# Altium schematic sheet DCM y ULTRASONIDO 1.3 .SchDoc
size A4; SheetNumber: 3; SheetTotal: 3
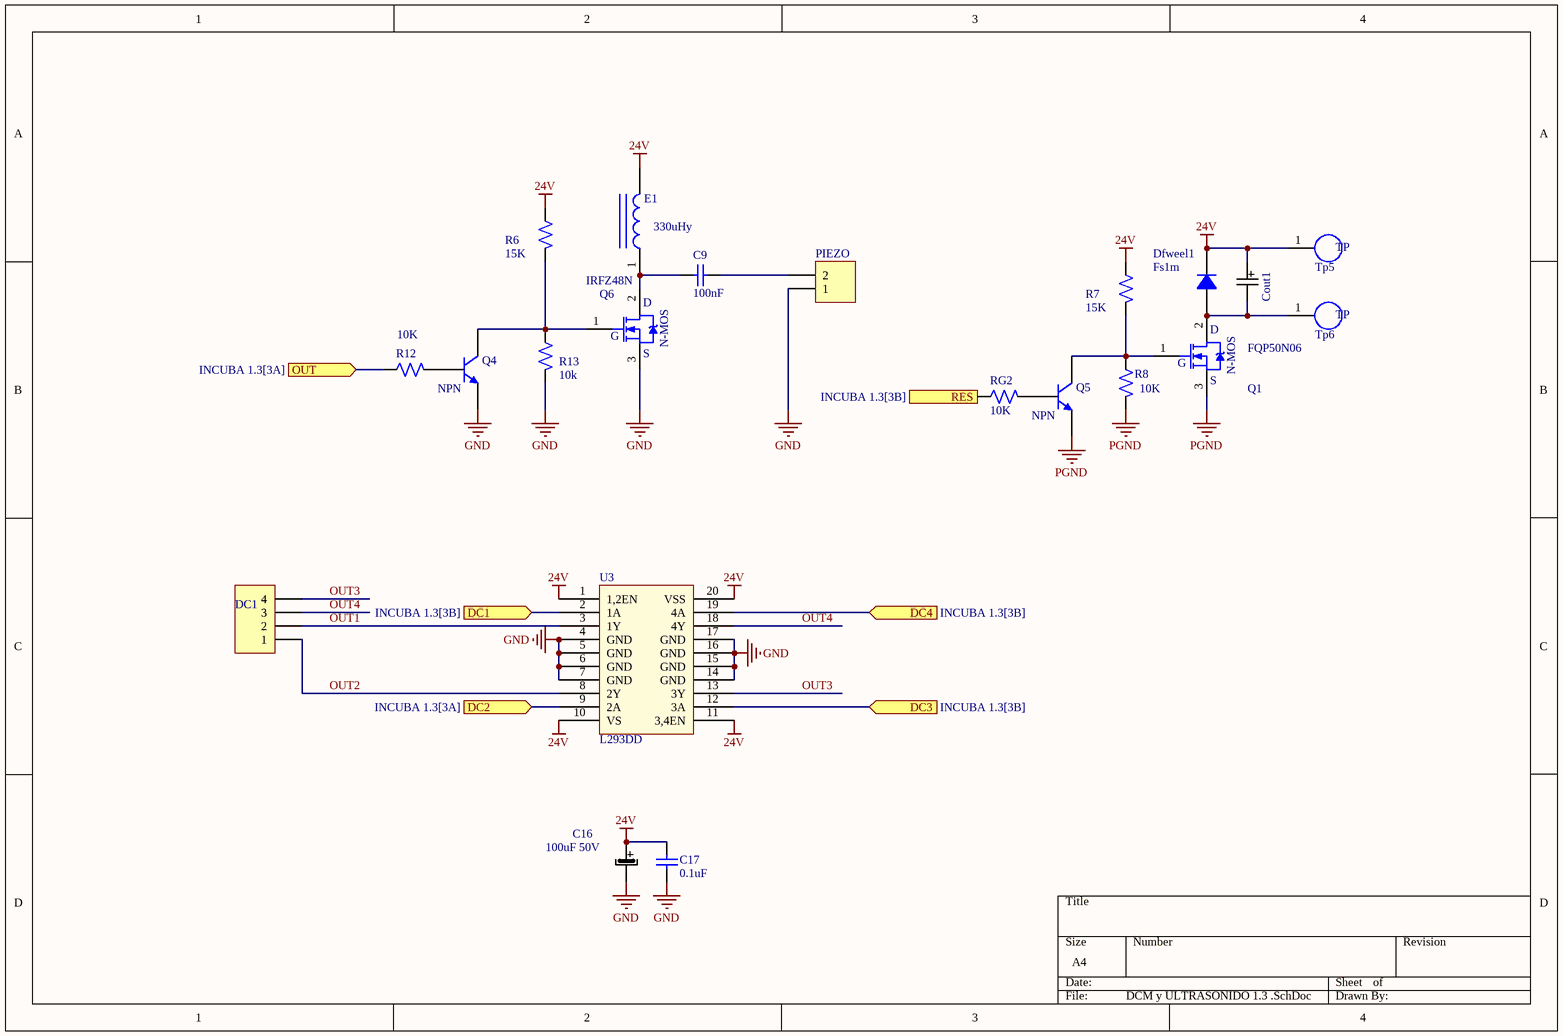
[diagram p0: DCM y ULTRASONIDO 1.3 .SchDoc]

## Parts
C9  value 100nF  [0805]
C16  value 100uF 50V  [cap100]  (hidden comment: Capacitor)
C17  value 0.1uF  [0805]
Cout1  Cout  [0805]  (value not drawn)
DC1  Header 4  [HDR1X4]  (value not drawn)
Dfweel1  Fs1m  [DO-214AC]
E1  value 330uHy  [res200]  (hidden comment: Inductor Iron)
PIEZO  Header 2  [HDR1X2]  (value not drawn)
Q1  FQP50N06  [TO-220]
Q4  NPN  [SOT23-5_hall]
Q5  NPN  [SOT23-5_hall]
Q6  IRFZ48N  [TO-220]
R6  value 15K  [0805]  (hidden comment: Resistencia)
R7  value 15K  [0805]  (hidden comment: Resistencia)
R8  value 10K  [0805]  (hidden comment: Resistencia)
R12  value 10K  [0805]  (hidden comment: Resistencia)
R13  value 10k  [0805]  (hidden comment: Resistencia)
RG2  value 10K  [0805]  (hidden comment: RG)
Tp5  Testpoint  [Testpoint]  (value not drawn)
Tp6  Testpoint  [Testpoint]  (value not drawn)
U3  L293DD  [SOIC127P1032X265-20N]

## Ports
DC1 (in, see INCUBA 1.3[3B]), DC2 (in, see INCUBA 1.3[3A]), DC3 (in, see INCUBA 1.3[3B]), DC4 (in, see INCUBA 1.3[3B]), OUT (in, see INCUBA 1.3[3A]), RES (in, see INCUBA 1.3[3B])

## Nets
24V: C16.2 C17.1 Cout1.2 Dfweel1.1(K) E1.2 R6.2 R7.2 Tp5.1(TP) U3.1(1,2EN) U3.10(VS) U3.11(3,4EN) U3.20(VSS)
GND: C16.1 C17.2 PIEZO.1 Q4.2(E) Q6.3(S) R13.1 U3.4(GND) U3.5(GND) U3.6(GND) U3.7(GND) U3.14(GND) U3.15(GND) U3.16(GND) U3.17(GND)
PGND: Q1.3(S) Q5.2(E) R8.1
DC1: U3.2(1A) ; port DC1
DC2: U3.9(2A) ; port DC2
DC3: U3.12(3A) ; port DC3
DC4: U3.19(4A) ; port DC4
OUT: R12.2 ; port OUT
OUT1: DC1.2 U3.3(1Y)
OUT2: DC1.1 U3.8(2Y)
OUT3: DC1.4 U3.13(3Y)
OUT4: DC1.3 U3.18(4Y)
RES: RG2.1 ; port RES
NetC9_1: C9.1 E1.1 Q6.2(D)
NetC9_2: C9.2 PIEZO.2
NetCout1_1: Cout1.1 Dfweel1.2(A) Q1.2(D) Tp6.1(TP)
NetQ1_1: Q1.1(G) Q5.3(C) R7.1 R8.2
NetQ4_1: Q4.1(B) R12.1
NetQ4_3: Q4.3(C) Q6.1(G) R6.1 R13.2
NetQ5_1: Q5.1(B) RG2.2

## Notes on the sheet
- (in symbol IRFZ48N) N-MOS

## Library data of the parts
C9 C17 = Cap SMD: Capacitor; Published: 8-Jun-2000; LatestRevisionDate: 29-May-2009; LatestRevisionNote: IPC-7351 Footprint Added.; PackageReference: C0805; Publisher: Altium Limited; PackageDescription: Chip Capacitor
C16 = Capacitor_Polarizado: Capacitor Polarizado
Cout1 = Capacitor
DC1 = Header 4: Header, 4-Pin; LatestRevisionDate: 17-Jul-2002; LatestRevisionNote: Re-released for DXP Platform.; Publisher: Altium Limited
Dfweel1 = Diodo: DSK14 , US1M. Fs1m; Published: 8-Jun-2000; LatestRevisionDate: 17-Jul-2002; LatestRevisionNote: Re-released for DXP Platform.; PackageDocument: Sep-1996; PackageReference: SMC; Publisher: Altium Limited; Code_JEDEC: DO-214-AB
E1 = Inductor Iron: Magnetic-Core Inductor; Published: 24-Mar-1999; LatestRevisionDate: 17-Jul-2002; LatestRevisionNote: Re-released for DXP Platform.; PackageReference: AXIAL-0.9; Publisher: Altium Limited
PIEZO = Header 2: Header, 2-Pin; LatestRevisionDate: 17-Jul-2002; LatestRevisionNote: Re-released for DXP Platform.; Publisher: Altium Limited
Q1 Q6 = IRFZ48N: IRLZ44; Note: Pin 2 is electrically connected to pin 4.; Published: 8-Jun-2000; LatestRevisionDate: 17-Jul-2002; LatestRevisionNote: Re-released for DXP Platform.; DatasheetVersion: PD-9.814; PackageVersion: Feb-1997; PackageReference: TO-220AB; Publisher: Altium Limited; PackageDescription: TO, Thru-Hole, Vertical, Heatsink Mounted; 3 In-Line Leads; Pitch 2.54 mm; ComponentLink1Description: Manufacturer Link; ComponentLink1URL: http://www.irf.com/
Q4 Q5 = GMBT2222A
R6-R8 R12 R13 RG2 = Resistencia: Resistencia  de con varios Footprint
Tp5 Tp6 = Testpoint: Tespoint